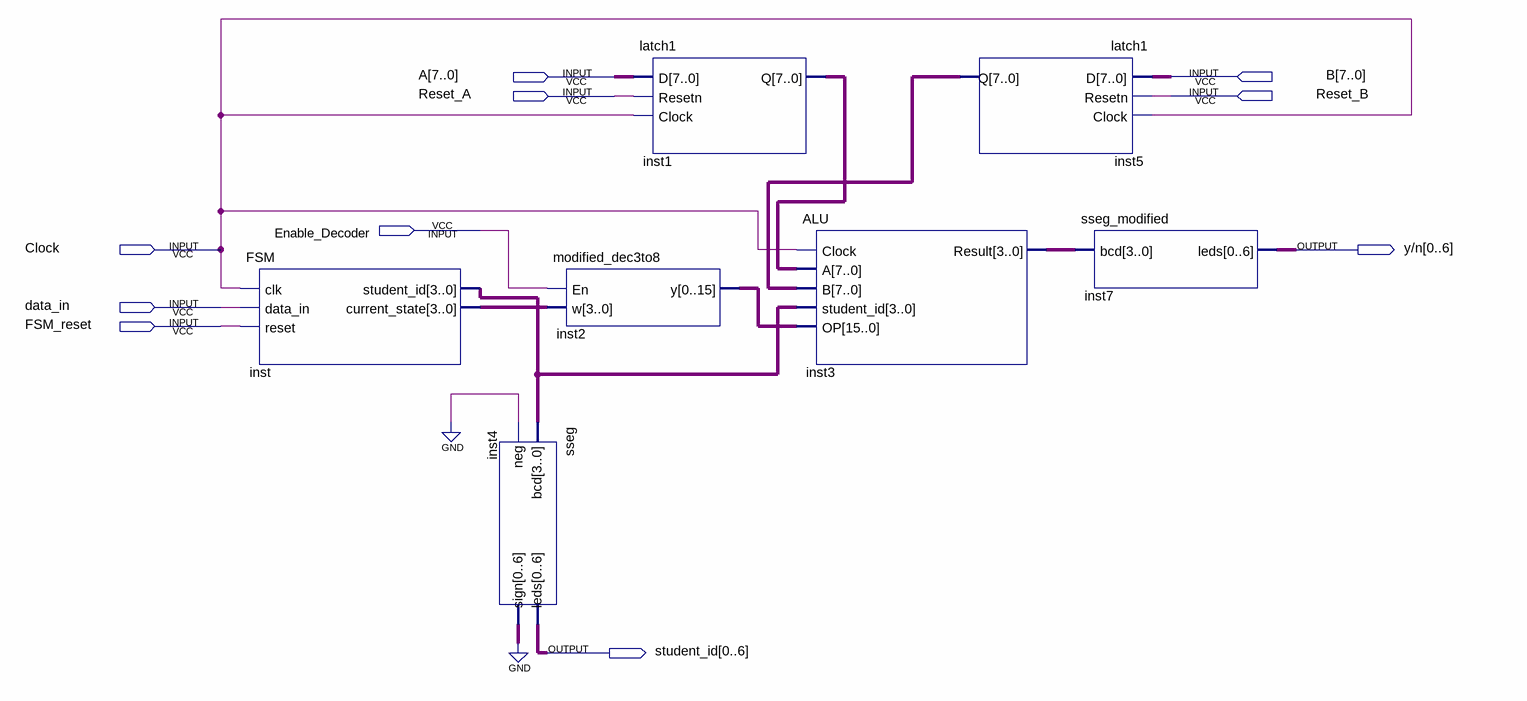
[diagram p0: schematic sheet]
// Quartus schematic block_schematic3.bdf as structural Verilog: 7 symbols, 10 pins
module block_schematic3 (
  input  [7:0] A,
  input  [7:0] B,
  input  Reset_A,
  input  Reset_B,
  input  Enable_Decoder,
  input  Clock,
  input  data_in,
  input  FSM_reset,
  output [0:6] \y/n ,
  output [0:6] student_id
);

  wire [3:0] inst3_result, inst_current_state, inst_student_id;
  wire [6:0] inst4_sign;
  wire [7:0] inst1_q, inst5_q;
  wire [15:0] inst2_y;

  FSM inst (
    .clk(Clock), .data_in(data_in), .reset(FSM_reset), .student_id(inst_student_id),
    .current_state(inst_current_state));
  sseg inst4 (.bcd(inst_student_id), .neg(1'b0), .leds(student_id), .sign(inst4_sign));
  modified_dec3to8 inst2 (.En(Enable_Decoder), .w(inst_current_state), .y(inst2_y));
  latch1 inst1 (.D(A), .Resetn(Reset_A), .Clock(Clock), .Q(inst1_q));
  ALU inst3 (
    .Clock(Clock), .A(inst1_q), .B(inst5_q), .student_id(inst_student_id), .OP(inst2_y), .Result(inst3_result));
  latch1 inst5 (.D(B), .Resetn(Reset_B), .Clock(Clock), .Q(inst5_q));
  sseg_modified inst7 (.bcd(inst3_result), .leds(\y/n ));
  // also tied to GND on the sheet: {inst4_sign[0], inst4_sign[1], inst4_sign[2], inst4_sign[3], inst4_sign[4], inst4_sign[5], inst4_sign[6]}
endmodule
